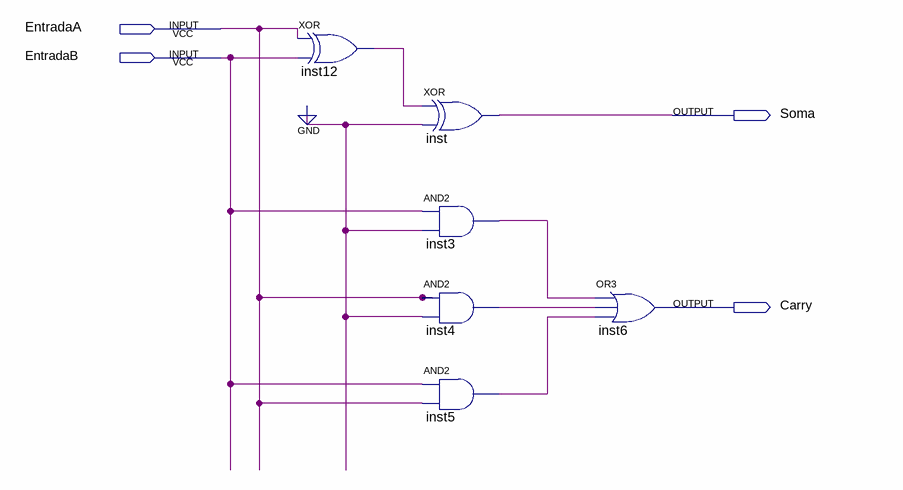
[diagram p0: schematic sheet]
// Quartus schematic SomadorGND_SD.bdf as structural Verilog: 6 symbols, 4 pins
module SomadorGND_SD (
  input  EntradaA,
  input  EntradaB,
  output Soma,
  output Carry
);

  wire inst3_out, inst4_out, inst5_out, inst12_out;

  xor inst12 (inst12_out, EntradaA, EntradaB);
  xor inst (Soma, inst12_out, 1'b0);
  and inst3 (inst3_out, EntradaB, 1'b0);
  and inst4 (inst4_out, EntradaA, 1'b0);
  and inst5 (inst5_out, EntradaB, EntradaA);
  or inst6 (Carry, inst3_out, inst4_out, inst5_out);
endmodule
